# EAGLE design IOSeven (EAGLE 7.4.0)
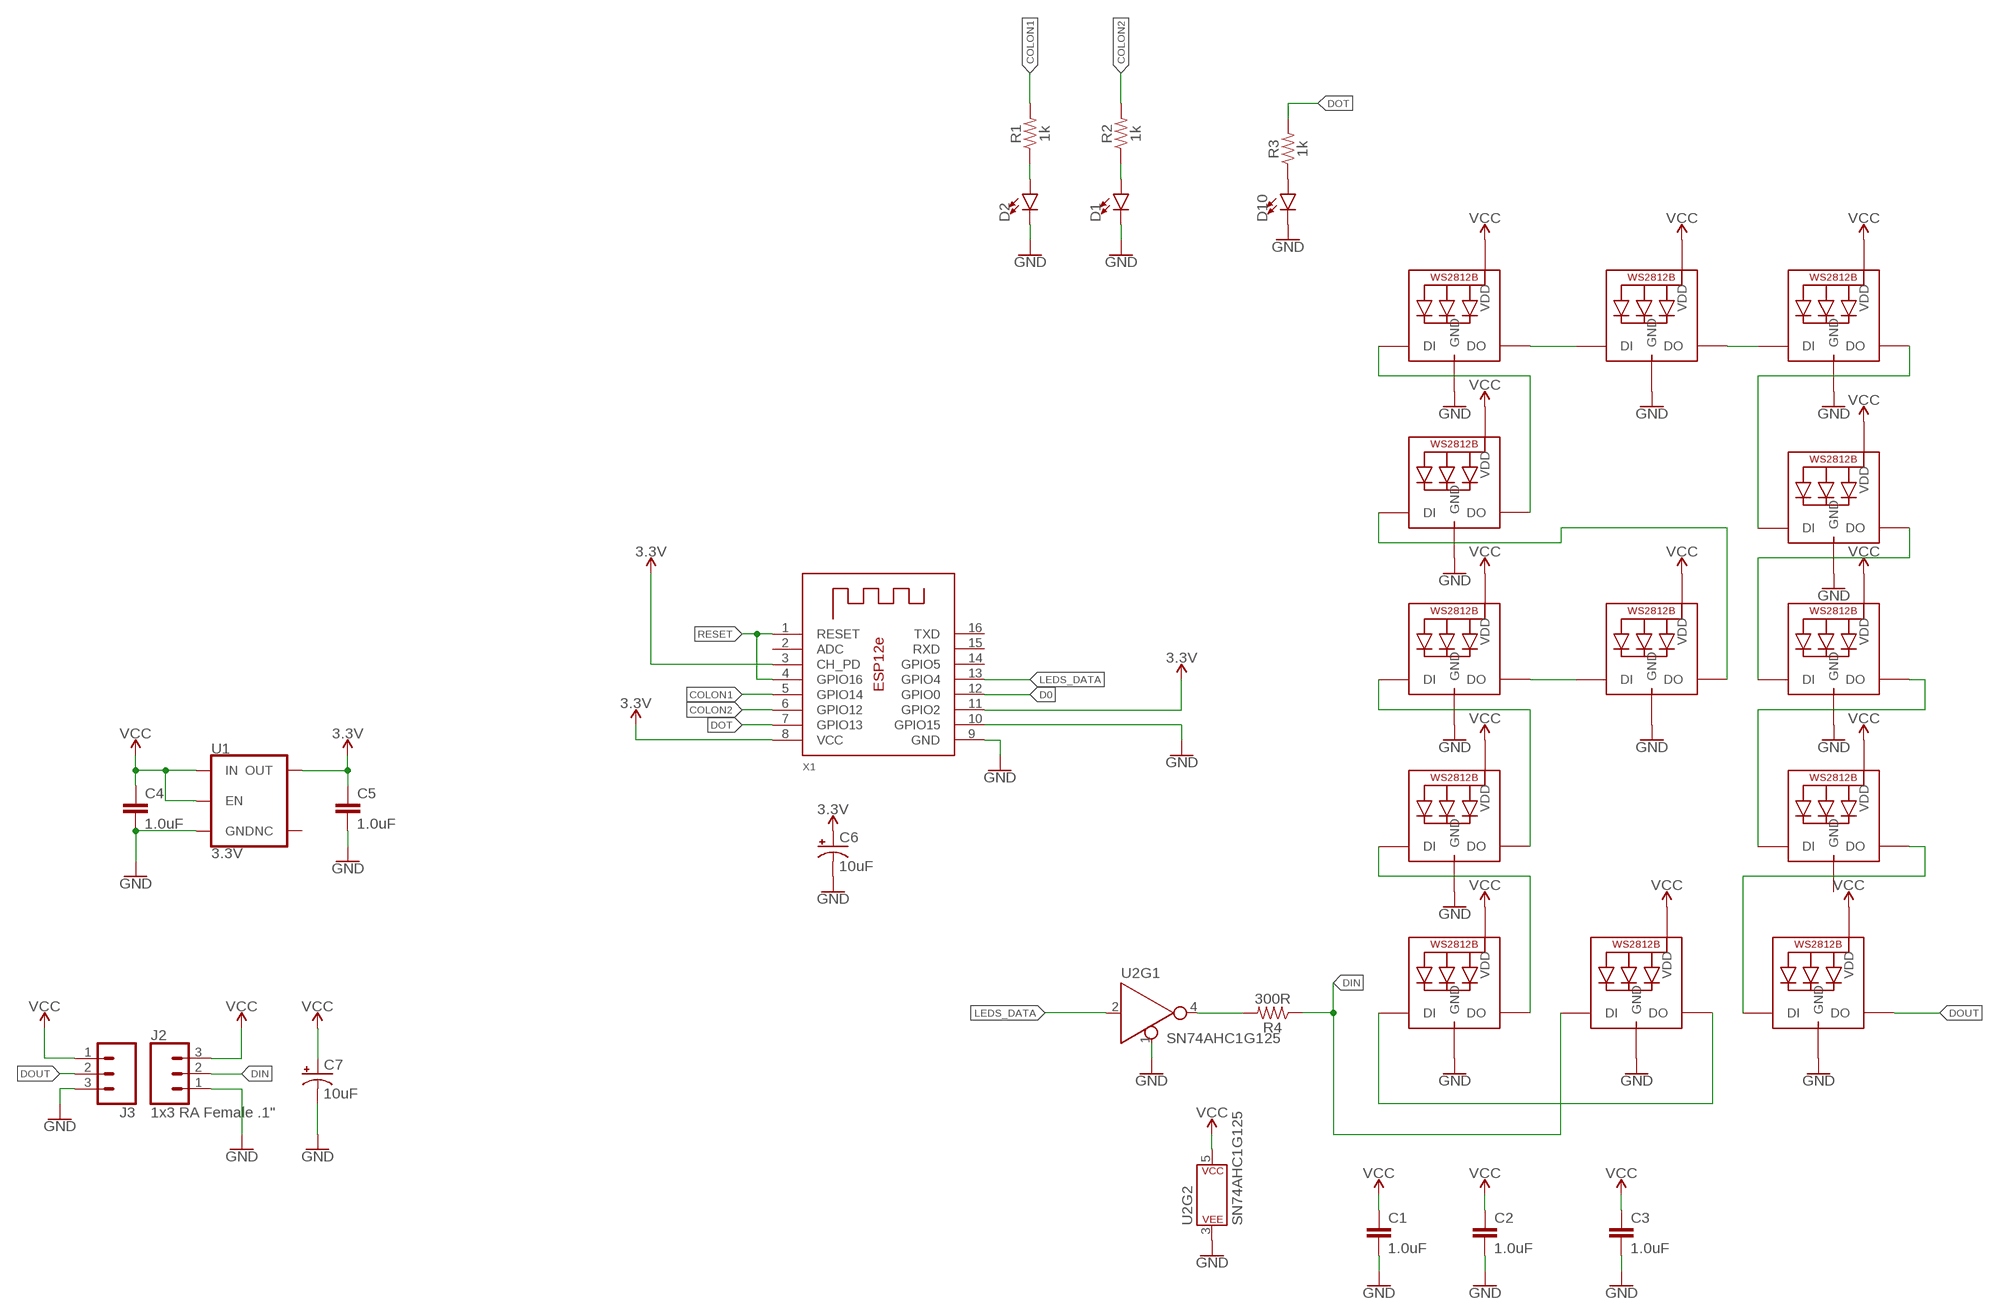
[diagram p0: schematic, sheet 1]

## Parts
C1  1.0uF  1.0UF-0603-16V-10%  [0603]
C2  1.0uF  1.0UF-0603-16V-10%  [0603]
C3  1.0uF  1.0UF-0603-16V-10%  [0603]
C4  1.0uF  1.0UF-0603-16V-10%  [0603]
C5  1.0uF  1.0UF-0603-16V-10%  [0603]
C6  10uF  10UF-POLAR-0603-6.3V-20%(TANT)  [0603-POLAR]
C7  10uF  10UF-POLAR-0603-6.3V-20%(TANT)  [0603-POLAR]
D1  LED0603  [LED-0603]
D2  LED0603  [LED-0603]
D10  LED0603  [LED-0603]
J2  1x3 RA Female .1"  CONN_03SMD_RA_FEMALE  [1X03_SMD_RA_FEMALE]
J3  CONN_03SMD_RA_MALE  [1X03_SMD_RA_MALE]
LED17  WS2812B3535  [LED3535]
LED18  WS2812B3535  [LED3535]
LED19  WS2812B3535  [LED3535]
LED20  WS2812B3535  [LED3535]
LED21  WS2812B3535  [LED3535]
LED22  WS2812B3535  [LED3535]
LED23  WS2812B3535  [LED3535]
LED24  WS2812B3535  [LED3535]
LED25  WS2812B3535  [LED3535]
LED26  WS2812B3535  [LED3535]
LED27  WS2812B3535  [LED3535]
LED28  WS2812B3535  [LED3535]
LED29  WS2812B3535  [LED3535]
R1  1k  1KOHM-0603-1/10W-1%  [0603]
R2  1k  1KOHM-0603-1/10W-1%  [0603]
R3  1k  1KOHM-0603-1/10W-1%  [0603]
R4  300R  1KOHM-0603-1/10W-1%  [0603]
U1  3.3V  V_REG_AP2112K-3.3V  [SOT23-5]
U2  SN74AHC1G125  74AHC1G125D  [SOT23-5]
X1  ESP-12E  [ESP-12E]

## Nets
3.3V: C5.1 C6.+ U1.5(OUT) X1.3(CH_PD) X1.8(VCC) X1.11(GPIO2)
COLON1: R1.2 X1.5(GPIO14)
COLON2: R2.2 X1.6(GPIO12)
D0: X1.12(GPIO0)
DIN: J2.2 LED28.1(DI) R4.1
DOT: R3.2 X1.7(GPIO13)
DOUT: J3.2 LED27.3(DO)
GND: C1.2 C2.2 C3.2 C4.2 C5.2 C6.- C7.- D1.C D2.C D10.C J2.1 J3.3 LED17.4(GND) LED18.4(GND) LED19.4(GND) LED20.4(GND) LED21.4(GND) LED22.4(GND) LED23.4(GND) LED24.4(GND) LED25.4(GND) LED27.4(GND) LED28.4(GND) LED29.4(GND) U1.2(GND) U2.1(!EN) U2.3(P$V-) X1.9(GND) X1.10(GPIO15)
LEDS_DATA: U2.2(A) X1.13(GPIO4)
N$1: R4.2 U2.4(Y)
N$2: LED17.1(DI) LED28.3(DO)
N$3: LED21.3(DO) LED22.1(DI)
N$4: LED20.3(DO) LED21.1(DI)
N$5: D2.A R1.1
N$6: D1.A R2.1
N$7: D10.A R3.1
N$8: LED19.3(DO) LED29.1(DI)
N$9: LED20.1(DI) LED29.3(DO)
N$10: LED18.3(DO) LED19.1(DI)
N$12: LED17.3(DO) LED18.1(DI)
N$15: LED26.3(DO) LED27.1(DI)
N$16: LED25.3(DO) LED26.1(DI)
N$17: LED22.3(DO) LED23.1(DI)
N$18: LED23.3(DO) LED24.1(DI)
N$19: LED24.3(DO) LED25.1(DI)
RESET: X1.1(RESET) X1.4(GPIO16)
VCC: C1.1 C2.1 C3.1 C4.1 C7.+ J2.3 J3.1 LED17.2(VDD) LED18.2(VDD) LED19.2(VDD) LED20.2(VDD) LED21.2(VDD) LED22.2(VDD) LED23.2(VDD) LED24.2(VDD) LED25.2(VDD) LED26.2(VDD) LED27.2(VDD) LED28.2(VDD) LED29.2(VDD) U1.1(IN) U1.3(EN) U2.5(P$V+)
Unconnected: U1.4(NC) X1.2(ADC) X1.14(GPIO5) X1.15(RXD) X1.16(TXD)

## Power pins joined to a net without a drawn wire
GND: LED26.4(GND)

## Library data of the parts
C1-C5 = SparkFun-Capacitors:1.0UF: 1µF ceramic capacitors A capacitor is a passive two-terminal electrical component used to store electrical energy temporarily in an electric field.; PROD_ID: CAP-00868
C6 C7 = SparkFun-Capacitors:10UF-POLAR: 10.0µF polarized capacitors A capacitor is a passive two-terminal electrical component used to store electrical energy temporarily in an electric field.; PROD_ID: CAP-13210
D1 D2 D10 = SparkFun-LED:LED: LED (Generic) Standard schematic elements and footprints for 5mm, 3mm, 1206, and 0603 sized LEDs. Generic LEDs with no color specified.
J2 = SparkFun-Connectors:CONN_03: Multi connection point. Often used as Generic Header-pin footprint for 0.1 inch spaced/style header connections On any of the 0.1 inch spaced packages, you can populate with these: Break Away Headers - Straight <https://www.sparkfun.com/products/116> (PRT-00116) Break Away Male Headers - Right Angle <https://www.sparkfun.com/products/553> (PRT-00553) Female Headers <https://www.sparkfun.com/products/115> (PRT-00115) Break Away Headers - Machine Pin <https://www.sparkfun.com/products/117> (PRT-00117) Break Away Female Headers - Swiss Machine Pin <https://www.sparkfun.com/products/743> (PRT-00743) Stackable Header - 3 Pin (Female, 0.1") <https://www.sparkfun.com/products/13875> (PRT-13875) For SCREWTERMINALS and SPRING TERMINALS visit here: Screw Terimnals on SparkFun.com <https://www.sparkfun.com/search/results?term=Screw+Terminals> (5mm/3.5mm/2.54mm spacing) This device is also useful as a general connection point to wire up your design to another part of your project. Our various solder wires solder well into these plated through hole pads. Hook-Up Wire - Assortment (Stranded, 22 AWG) <https://www.sparkfun.com/products/11375> (PRT-11375) Hook-Up Wire - Assortment (Solid Core, 22 AWG) <https://www.sparkfun.com/products/11367> (PRT-11367) View the entire wire category on our website here <https://www.sparkfun.com/categories/141> Special notes: Molex polarized connector foot print use with SKU : PRT-08232 with associated crimp pins and housings.; PROD_ID: CONN-10926
J3 = SparkFun-Connectors:CONN_03: Multi connection point. Often used as Generic Header-pin footprint for 0.1 inch spaced/style header connections On any of the 0.1 inch spaced packages, you can populate with these: Break Away Headers - Straight <https://www.sparkfun.com/products/116> (PRT-00116) Break Away Male Headers - Right Angle <https://www.sparkfun.com/products/553> (PRT-00553) Female Headers <https://www.sparkfun.com/products/115> (PRT-00115) Break Away Headers - Machine Pin <https://www.sparkfun.com/products/117> (PRT-00117) Break Away Female Headers - Swiss Machine Pin <https://www.sparkfun.com/products/743> (PRT-00743) Stackable Header - 3 Pin (Female, 0.1") <https://www.sparkfun.com/products/13875> (PRT-13875) For SCREWTERMINALS and SPRING TERMINALS visit here: Screw Terimnals on SparkFun.com <https://www.sparkfun.com/search/results?term=Screw+Terminals> (5mm/3.5mm/2.54mm spacing) This device is also useful as a general connection point to wire up your design to another part of your project. Our various solder wires solder well into these plated through hole pads. Hook-Up Wire - Assortment (Stranded, 22 AWG) <https://www.sparkfun.com/products/11375> (PRT-11375) Hook-Up Wire - Assortment (Solid Core, 22 AWG) <https://www.sparkfun.com/products/11367> (PRT-11367) View the entire wire category on our website here <https://www.sparkfun.com/categories/141> Special notes: Molex polarized connector foot print use with SKU : PRT-08232 with associated crimp pins and housings.; PROD_ID: CONN-10925
LED17-LED29 = adafruit:WS2812B
R1-R3 = SparkFun-Resistors:1KOHM: 1kΩ resistor A resistor is a passive two-terminal electrical component that implements electrical resistance as a circuit element. Resistors act to reduce current flow, and, at the same time, act to lower voltage levels within circuits. - Wikipedia; PROD_ID: RES-07856
R4 = SparkFun-Resistors:1KOHM: 1kΩ resistor A resistor is a passive two-terminal electrical component that implements electrical resistance as a circuit element. Resistors act to reduce current flow, and, at the same time, act to lower voltage levels within circuits. - Wikipedia; PROD_ID: RES-07856; VALUE: 1k
U1 = SparkFun-IC-Power:V_REG_AP2112: AP2112 - 600mA CMOS LDO Regulator w/ Enable The AP2112 is CMOS process low dropout linear regulator with enable function, the regulator delivers a guaranteed 600mA (min.) continuous load current. Features Output Voltage Accuracy: ±1.5% Output Current: 600mA (Min.) Foldback Short Current Protection: 50mA Enable Function to Turn ON/OFF VOUT Low Dropout Voltage (3.3V): 250mV (Typ.) @IOUT=600mA Excellent Load Regulation: 0.2%/A (Typ.) Excellent Line Regulation: 0.02%/V (Typ.) Low Quiescent Current: 55μA (Typ.) Low Standby Current: 0.01μA (Typ.) Low Output Noise: 50μVRMS PSRR: 100Hz -65dB, 1kHz -65dB OTSD Protection Stable with 1.0μF Flexible Cap: Ceramic, Tantalum and Aluminum Electrolytic Operation Temperature Range: -40°C to 85°C ESD: MM 400V, HBM 4000V; PROD_ID: VREG-12457
U2 = SparkFun-IC-Logic:74*1G125: Single buffer Buffers & Line Drivers Tri-State Single Bus SOT-23-5 Datasheet SparkFun Products SparkFun SAMD21 Mini Breakout <https://www.sparkfun.com/products/13664> (DEV-13664) SparkFun SAMD21 Dev Breakout <https://www.sparkfun.com/products/13672> (DEV-13672) SparkFun MIDI Shield <https://www.sparkfun.com/products/12898> (DEV-12898) SparkFun WiFi Shield - CC3000 <https://www.sparkfun.com/products/12071> (DEV-12071); PROD_ID: IC-11920
X1 = kanflo:ESP-12E: ESP12e module This is a copy of AdaFruit's device with correct pin order for GPIO4 and GPIO5.

## Board
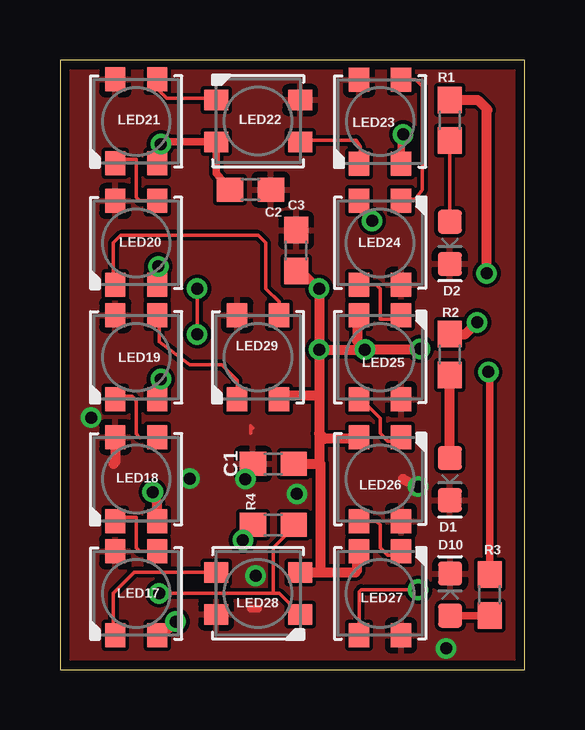
[diagram p1: board, top side]
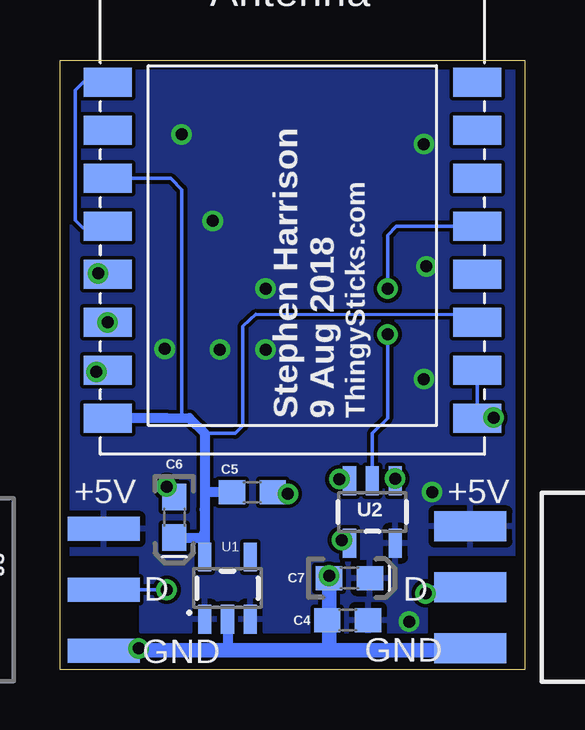
[diagram p2: board, bottom side, seen from below]

Size 19.36 x 25.4 mm. Coordinates in mm from the lower left corner, seen from the top.
Outline: 0,0 19.36,0 19.36,25.4 0,25.4 0,0
Copper layers (1*16): Top 0.0356mm / dielectric 1.5011mm / Bottom 0.0356mm
Design rules "OSHPark": minimum track width 6mil, minimum drill 13mil, track to track 6mil, track to pad 6mil, pad to pad 6mil, via to via 6mil, smd to smd 6mil, copper to edge 15mil, drill to drill 6mil, minimum pad ring 7mil, minimum via ring 7mil, stop-mask expansion 3mil, vias tented up to drill 0mil, thermal gap 10mil

### Footprints (pad centres in the part's own frame; a part is rotated, then mirrored left to right if it is on the bottom)
0603 = smd 1.1 x 1: 1 -0.85,0; 2 0.85,0
0603-POLAR = smd 1.1 x 1: + 0.85,0; - -0.85,0
LED-0603 = smd 1 x 1: A -0.877,0; C 0.877,0
1X03_SMD_RA_FEMALE = smd 1.25 x 3: 1 -2.54,7.225; 2 0,7.225; 3 2.54,7.225
1X03_SMD_RA_MALE = smd 1 x 3: 1 -2.54,5; 2 0,5; 3 2.54,5
LED3535 = smd 1 x 0.85: 1 -1.75,0.875; 2 -1.75,-0.875; 3 1.75,-0.875; 4 1.75,0.875
SOT23-5 = smd 0.55 x 1.2: 1 -0.95,-1.3; 2 0,-1.3; 3 0.95,-1.3; 4 0.95,1.3; 5 -0.95,1.3
ESP-12E = smd 2 x 1.2: 1 -7.7,4.5; 2 -7.7,2.5; 3 -7.7,0.5; 4 -7.7,-1.5; 5 -7.7,-3.5; 6 -7.7,-5.5; 7 -7.7,-7.5; 8 -7.7,-9.5; 9 7.7,-9.5; 10 7.7,-7.5; 11 7.7,-5.5; 12 7.7,-3.5; 13 7.7,-1.5; 14 7.7,0.5; 15 7.7,2.5; 16 7.7,4.5

### Placement (x,y rotation side)
C1  8.89,8.57 180 top
C2  7.94,20 0 top
C3  9.84,17.46 90 top
C4  7.38,2.06 180 bottom
C5  11.35,7.38 0 bottom
C6  14.61,6.35 270 bottom
C7  7.3,3.81 0 bottom
D1  16.25,7.94 270 top
D2  16.25,17.78 270 top
D10  16.25,3.12 90 top
J2  -4.96,3.43 90 bottom
J3  22.54,3.33 270 bottom
LED17  3.17,3.17 90 top
LED18  3.17,7.94 90 top
LED19  3.17,13.02 90 top
LED20  3.17,17.78 90 top
LED21  3.17,22.84 90 top
LED22  8.26,22.86 0 top
LED23  13.34,22.84 90 top
LED24  13.34,17.78 270 top
LED25  13.34,13.02 270 top
LED26  13.34,7.94 270 top
LED27  13.34,3.17 270 top
LED28  8.26,3.17 180 top
LED29  8.26,13.02 90 top
R1  16.25,22.89 90 top
R2  16.25,13.13 90 top
R3  17.91,3.11 90 top
R4  8.89,6.03 180 top
U1  12.38,3.39 0 bottom
U2  6.35,6.57 180 bottom
X1  9.68,19.97 0 bottom

### Tracks (layer width: path | path; a pad name or v marks a point on that pad's centre or on a via)
3.3V
  Bottom 0.152: 13.23,6.03 13.23,4.89 U1.5 | X1.3 14.75,20.47 14.29,20 14.29,10.49 14.93,10.49 | 13.26,7.38 13.34,6.67 | X1.11 2.68,14.79 11.21,14.8 11.75,14.3 11.75,10.16 12.06,9.84 13.34,9.84
  Bottom 0.406: X1.8 16.54,10.5 14.93,10.49 13.97,10.48 13.34,9.84 13.34,6.67 13.34,5.71 | 13.34,5.71 13.34,4.45 13.37,4.45 U1.5 | C6.+ 13.44,5.5 13.34,5.71 | C5.1 13.26,7.38
COLON1  (via drill 0.5)
  Top 0.406: R1.2 17.4,23.74 17.78,23.36 | 17.78,23.36 17.82,23.32 | v17.78,16.51 17.78,23.36
  Bottom 0.406: X1.5 17.74,16.47 v17.78,16.51
COLON2  (via drill 0.5)
  Top 0.406: R2.2 16.89,13.98 X1.6
  Bottom 0.406: X1.6 17.96,14.47 18.1,14.61
  other vias: 17.38,14.47
DIN  (via drill 0.5)
  Top 0.152: v4.13,3.17 8.89,3.17 | 8.89,3.17 9.13,3.17 LED28.1 | R4.1 9.74,5.93 8.89,5.08 8.89,3.17
  Bottom 0.152: J2.2 3.88,3.43 v4.13,3.17
DOT  (via drill 0.5)
  Top 0.305: R3.2 17.91,12.34 v17.85,12.4
  Bottom 0.152: 17.46,12.4 X1.7
  Bottom 0.406: v17.85,12.4 17.46,12.4
DOUT  (via drill 0.5)
  Top 0.152: LED27.3 12.46,3.24 12.55,3.33 v14.92,3.33
  Bottom 0.152: v14.92,3.33 J3.2
GND  (via drill 0.5)
  Top 0.152: 8.04,10.06 7.94,10.16 7.94,9.84
  Top 0.305: 8.26,2.54 7.94,2.54 | 6.75,2.54 LED28.4
  Top 0.406: LED18.4 2.3,8.65 2.22,8.57 | v14.92,7.62 14.29,7.94
  Bottom 0.152: 9.69,0.96 9.53,0.8 | X1.10 X1.9 | C4.2 8.1,2.38 8.15,2.02 | U2.3 7.43,7.97 v7.72,7.94 | U2.1 5.4,8.25 v5.4,7.96
  Bottom 0.305: J3.3 17.11,0.83 v16.09,0.89 | X1.9 1.17,10.47 v1.3,10.5
  Bottom 0.406: 17.08,0.8 17.11,0.83 | U1.2 12.38,0.8 | 15.16,7.7 v14.92,7.62 14.92,7.83 C6.- | J2.1 2.26,0.91 2.22,0.95 | C5.2 9.93,7.38 v9.87,7.33 | v8.15,3.91 C7.-
  Bottom 0.61: 8.14,0.89 8.15,0.91 8.15,2.02 v8.15,3.91 | 17.08,0.8 12.38,0.8 9.53,0.8 2.38,0.8 2.22,0.95 1.59,0.95
  pour Top (isolate 0.152, rank 4): 0,25.4 25.4,25.4 25.4,0 0,0
LEDS_DATA  (via drill 0.5)
  Top 0.152: v5.71,15.88 v5.71,13.97
  Bottom 0.152: X1.13 5.34,18.47 5.71,18.1 v5.71,15.88 | U2.2 6.35,9.84 5.71,10.48 v5.71,13.97
N$1  (via drill 0.5)
  Top 0.152: R4.2 v7.62,5.4
  Bottom 0.152: v7.62,5.4 7.27,5.71 U2.4
N$2
  Top 0.152: LED28.3 3.1,4.05 2.22,3.17 2.22,1.5 LED17.1
N$3
  Top 0.152: LED21.3 4.05,24.21 4.45,23.81 6.43,23.81 LED22.1
N$4
  Top 0.152: LED20.3 3.33,19.53 3.17,19.68 3.17,21.27 2.46,21.27 LED21.1
N$5
  Top 0.152: D2.A R1.1
N$6
  Top 0.406: D1.A R2.1
N$7
  Top 0.305: D10.A 17.89,2.25 R3.1
N$8
  Top 0.152: LED29.1 7.38,12.06 6.75,12.7 5.4,12.7 4.13,13.65 4.13,14.69 LED19.3
N$9
  Top 0.152: 2.46,15.88 LED20.1 2.22,16.11 2.22,17.78 2.54,18.1 8.26,18.1 8.57,17.78 8.57,15.88 9.13,15.32 LED29.3
N$10
  Top 0.152: LED18.3 3.33,9.67 3.17,9.82 3.17,11.21 3,11.4 2.46,11.41 LED19.1
N$11
  Top 0.406: 14.92,13.34 12.7,13.34
N$12
  Top 0.152: LED17.3 3.33,4.92 3.17,5.08 3.17,6.35 2.46,6.35 LED18.1
N$15
  Top 0.152: LED26.3 13.18,6.19 13.34,6.03 13.34,5.08 13.65,4.76 14.05,4.76 LED27.1
N$16
  Top 0.152: LED25.3 12.54,11.27 13.34,10.48 13.34,9.84 13.65,9.53 14.05,9.53 LED26.1
N$17
  Top 0.152: LED22.3 10.11,22 10.16,22.06 12.34,22.06 12.5,21.8 12.5,21.12 LED23.1
N$18
  Top 0.152: 14.29,19.61 LED24.1 14.28,19.6 14.8,19.6 15.1,20 15.1,24.3 14.81,24.59 LED23.3
N$19
  Top 0.152: LED24.3 13.18,16.03 13.34,15.88 13.34,14.61 14.05,14.61 LED25.1
RESET
  Bottom 0.152: X1.1 18.39,24.47 18.73,24.13 18.73,18.73 18.41,18.41 17.43,18.41 X1.4
VCC  (via drill 0.5)
  Top 0.152: LED18.2 4.05,6.59 4.13,6.67 | 4.13,21.91 v4.19,21.91 v4.2,21.9
  Top 0.305: 9.84,16.83 v10.79,15.88 | 9.29,11.43 LED29.2 | C2.1 6.5,20.69 LED22.2 4.29,21.98 v4.2,21.9 | 4.13,21.91 4.13,21.17 LED21.2 | 13.02,18.73 13.02,18.72 v13,18.7 | LED23.2 14.21,22.21 v14.3,22.3
  Top 0.406: LED17.2 4.21,1.35 | 12.38,4.76 12.46,4.84 LED27.2 12.38,4.85 12.38,4.13 12.3,4.05 10.79,4.05 | 13.02,18.73 12.38,19.45 LED24.2 | LED26.2 12.38,9.61 11.03,9.61 10.79,9.84 | C3.1 9.84,16.83 | 12.3,14.61 12.38,14.69 | 12.38,14.69 LED25.2 | v10.79,15.88 v10.79,13.34 | v10.79,13.34 10.79,11.43 | 10.79,11.43 10.79,9.84 | 10.79,9.84 10.79,8.63 10.85,8.57 | LED18.2 4.05,6.95 v3.87,7.4 | 4.21,1.35 4.21,1.29 | LED20.2 4.13,16.11 4.13,16.83 v4.1,16.8 | 10.85,8.57 10.85,4.11 10.79,4.05 | LED28.2 10.79,4.05 | C1.1 10.85,8.57 | 4.21,1.35 4.21,1.39 v4.82,2 | 12.38,14.69 12.38,13.7 v12.7,13.34 v10.79,13.34 | 9.29,11.43 10.79,11.43 | LED19.2 4.05,11.95 v4.2,12.1
  other vias: 15,13.37
  pour Bottom (isolate 0.152, rank 3): 0,25.4 20.3,25.5 20.3,4.8 16,4.8 16,1.59 4.1,1.55 4.1,4.8 0,4.8

### Text on the board
bNames: ThingySticks.com | Stephen Harrison / 9 Aug 2018 | +5V | +5V | D | D | GND | GND
tDocu: 6 | 7 | 8 | 5 | 9 | 3 | 4 | 10 | 2 | 11 | 1 | 0 | 12